# EAGLE schematic STM32L052_Breakout (EAGLE 9.1.1)
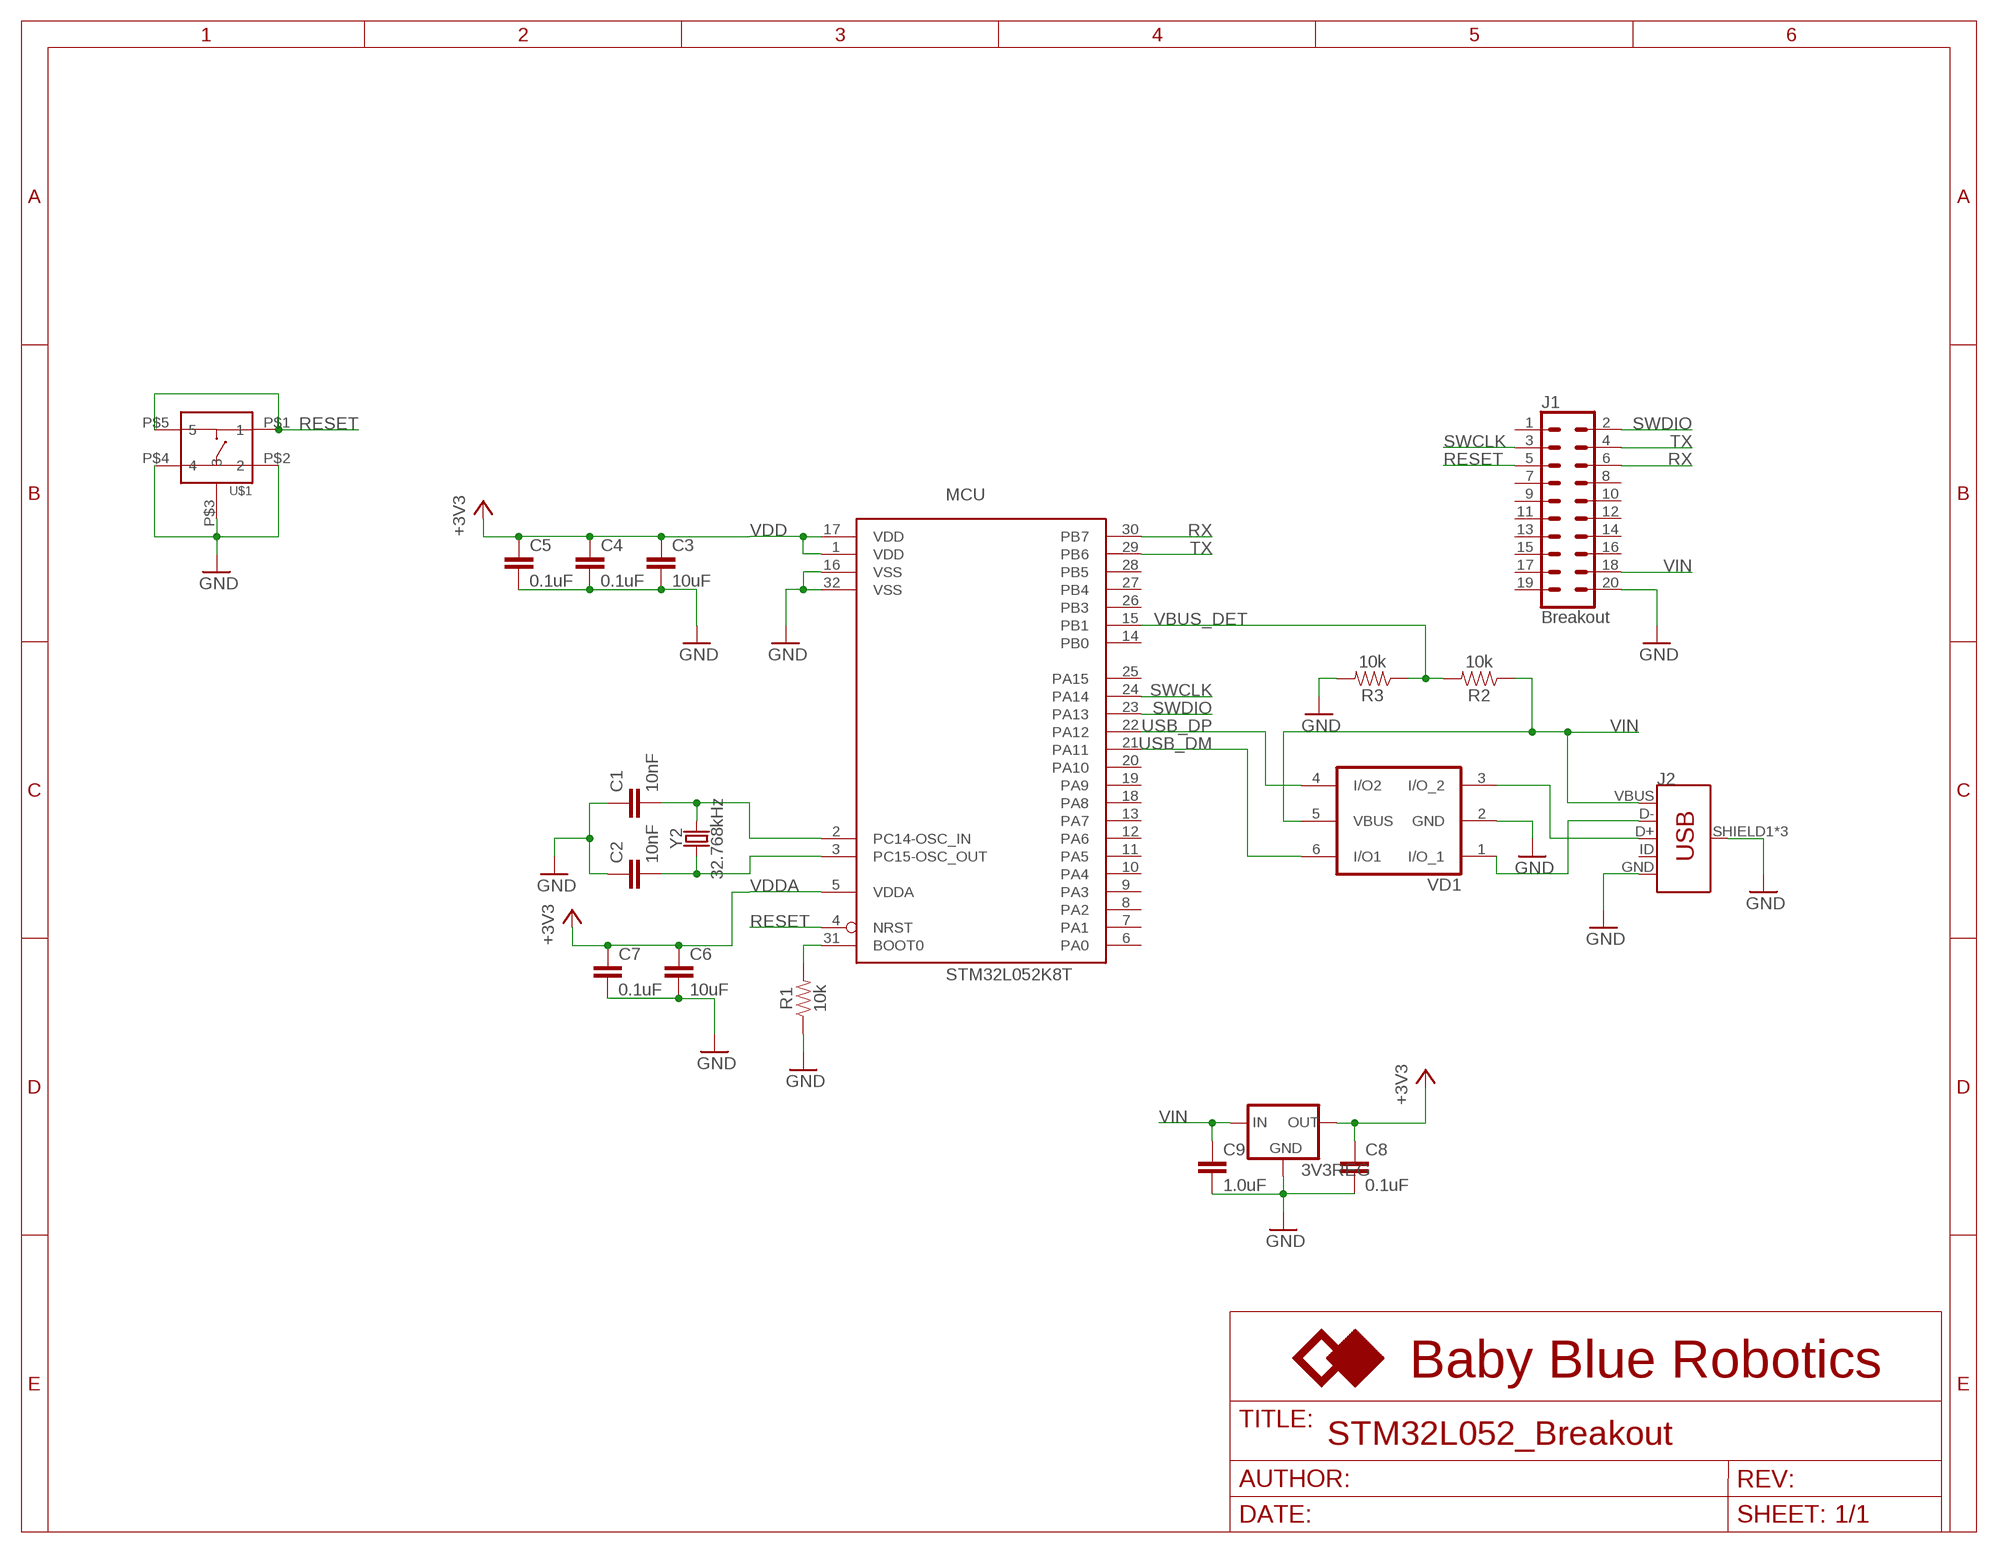
[diagram p0: schematic, sheet 1]
FRAME1 (FRAME_A_L): AUTHOR_NAME: Binit Shah; DATE_MODIFIED: 7/25/2018; REV: 1.0.0

## Parts
3V3REG  TLV76033DBZT  [SOT95P237X112-3]
C1  10nF  10NF-0603-50V-10%  [0603]
C2  10nF  10NF-0603-50V-10%  [0603]
C3  10uF  10UF-0603-6.3V-20%  [0603]
C4  0.1uF  0.1UF-0603-25V-(+80/-20%)  [0603]
C5  0.1uF  0.1UF-0603-25V-(+80/-20%)  [0603]
C6  10uF  10UF-0603-6.3V-20%  [0603]
C7  0.1uF  0.1UF-0603-25V-(+80/-20%)  [0603]
C8  0.1uF  0.1UF-0603-25V-(+80/-20%)  [0603]
C9  1.0uF  1.0UF-0603-16V-10%  [0603]
J1  Breakout  CONN_10X2  [2X10]
J2  USB_MICRO-B_FEMALE-SMT  [USB-B-MICRO-SMD]
MCU  STM32L052K8T  MICRO-STM_V3_STM32L052K8T  [MICRO-STM_V3_LQFP32]
R1  10k  10KOHM-0603-1/10W-1%  [0603]
R2  10k  10KOHM-0603-1/10W-1%  [0603]
R3  10k  10KOHM-0603-1/10W-1%  [0603]
U$1  KMS231GLFS  [KMS231GLFS]
VD1  USBLC6_USBLC6-2SC6  [USBLC6_SOT-23-6L]
Y2  32.768kHz  CRYSTAL-32.768KHZSMD-3.2X1.5  [CRYSTAL-SMD-3.2X1.5MM]

## Nets
+3V3: 3V3REG.1(OUT) C8.1
GND: 3V3REG.3(GND) C1.1 C2.1 C3.2 C4.2 C5.2 C6.2 C7.2 C8.2 C9.2 J1.20 J2.GND J2.SHIELD1(SHIELD) J2.SHIELD2(SHIELD) J2.SHIELD3(SHIELD) MCU.16(VSS) MCU.32(VSS) R1.1 R3.2 U$1.P$2 U$1.P$3 U$1.P$4 VD1.2(GND)
N$1: MCU.31(BOOT0) R1.2
N$2: C2.2 MCU.3(PC15-OSC_OUT) Y2.P$1
N$3: C1.2 MCU.2(PC14-OSC_IN) Y2.P$2
N$5: J2.D+ VD1.3(I/O_2)
N$6: J2.D- VD1.1(I/O_1)
RESET: J1.5 MCU.4(NRST) U$1.P$1 U$1.P$5
RX: J1.6 MCU.30(PB7)
SWCLK: J1.3 MCU.24(PA14)
SWDIO: J1.2 MCU.23(PA13)
TX: J1.4 MCU.29(PB6)
USB_DM: MCU.21(PA11) VD1.6(I/O1)
USB_DP: MCU.22(PA12) VD1.4(I/O2)
VBUS_DET: MCU.15(PB1) R2.2 R3.1
VDD: C3.1 C4.1 C5.1 MCU.1(VDD) MCU.17(VDD) ; supply symbol labelled +3V3
VDDA: C6.1 C7.1 MCU.5(VDDA) ; supply symbol labelled +3V3
VIN: 3V3REG.2(IN) C9.1 J1.18 J2.VBUS R2.1 VD1.5(VBUS)
Unconnected: J1.1 J1.7 J1.8 J1.9 J1.10 J1.11 J1.12 J1.13 J1.14 J1.15 J1.16 J1.17 J1.19 J2.ID MCU.6(PA0) MCU.7(PA1) MCU.8(PA2) MCU.9(PA3) MCU.10(PA4) MCU.11(PA5) MCU.12(PA6) MCU.13(PA7) MCU.14(PB0) MCU.18(PA8) MCU.19(PA9) MCU.20(PA10) MCU.25(PA15) MCU.26(PB3) MCU.27(PB4) MCU.28(PB5)

## Library data of the parts
3V3REG = TLV76033DBZT:TLV76033DBZT: TLV76033DBZT A Linear Regulator by TI that outputs 3.3v Arrow https://www.arrow.com/en/products/tlv76033dbzt/texas-instruments Datasheet https://www.snapeda.com/parts/TLV76033DBZT/Texas%20Instruments/datasheet/ EasyEDA A EasyEDA footprint was imported before I used the Eagle Package generator to generate the 3D model and footprint. I'm keeping the EasyEDA one in case the Eagle generated one does not work.
C1 C2 = SparkFun-Capacitors:10NF: 0.01uF/10nF/10,000pF ceramic capacitors A capacitor is a passive two-terminal electrical component used to store electrical energy temporarily in an electric field. CAP-09321; PROD_ID: CAP-00867
C3 C6 = SparkFun-Capacitors:10UF: 10.0µF ceramic capacitors A capacitor is a passive two-terminal electrical component used to store electrical energy temporarily in an electric field.; PROD_ID: CAP-11015
C4 C5 C7 C8 = SparkFun-Capacitors:0.1UF: 0.1µF ceramic capacitors A capacitor is a passive two-terminal electrical component used to store electrical energy temporarily in an electric field.; PROD_ID: CAP-00810
C9 = SparkFun-Capacitors:1.0UF: 1µF ceramic capacitors A capacitor is a passive two-terminal electrical component used to store electrical energy temporarily in an electric field.; PROD_ID: CAP-00868
J1 = SparkFun-Connectors:CONN_10X2: Multi connection point. Often used as Generic Header-pin footprint for 0.1 inch spaced/style header connections On any of the 0.1 inch spaced packages, you can populate with these: Break Away Headers - Straight <https://www.sparkfun.com/products/116> (PRT-00116) Break Away Male Headers - Right Angle <https://www.sparkfun.com/products/553> (PRT-00553) Female Headers <https://www.sparkfun.com/products/115> (PRT-00115) Break Away Headers - Machine Pin <https://www.sparkfun.com/products/117> (PRT-00117) Break Away Female Headers - Swiss Machine Pin <https://www.sparkfun.com/products/743> (PRT-00743) Special note about the "SPECIAL" package: This was SPECIALLY designed to be used with our Graphic LCD Backpack. Be sure you want to use this! It is not only staggered on each line of header holes, but IT IS ALSO offset of the center point of the top and bottom lines by 5 mil. This causes the headers to lock into place on the "standard" footprint on the LCD screen. The extra squares on the tdocu layer are there simply to reference other pins (if you were to actually populate a longer header than ten long - this is what we do with the backpacks).
J2 = SparkFun-Connectors:USB_MICRO-B: USB Type Micro-B Connector Male/female and PTH/SMT variants SparkFun Products: SparkFun microB USB Breakout <https://www.sparkfun.com/products/12035> SparkFun USB microB Plug Breakout <https://www.sparkfun.com/products/10031> SparkFun ESP8266 Thing <https://www.sparkfun.com/products/13231>; PROD_ID: CONN-11752
MCU = STM32L052:MICRO-STM_V3_STM32L052K*T: ARM 32-bit Cortex™-M0+ CPU 32 MHz maximum frequency 32 to 64 Kbytes of Flash memory 2 kbyte of Data EEPROM 8 kbytes of SRAM 27 GPIOs 1.8 to 3.6 V application supply
R1-R3 = SparkFun-Resistors:10KOHM: 10kΩ resistor A resistor is a passive two-terminal electrical component that implements electrical resistance as a circuit element. Resistors act to reduce current flow, and, at the same time, act to lower voltage levels within circuits. - Wikipedia; PROD_ID: RES-00824
U$1 = KMS_Switches:KMS231GLFS
VD1 = USBC6:USBLC6_USBLC6-2: VERY LOW CAPACITANCE ESD PROTECTION 2 line Datasheet link <http://www.st.com/web/catalog/sense_power/FM114/CL1137/SC1489/PF93353>
Y2 = SparkFun-Clocks:CRYSTAL-32.768KHZ: 32.768kHz Crystal Frequency: 32.768kHz Frequency Stability: ±20ppm Load Capacitance: 12.5pF (PTH-2X6 & SMD-3.2X1.5), 6pF (SMD-2X6) SparkFun Products: SparkFun BigTime Watch Kit <https://www.sparkfun.com/products/11734> SparkFun nRF52832 Breakout <https://www.sparkfun.com/products/13990> SparkFun Real Time Clock Module <https://www.sparkfun.com/products/12708>; PROD_ID: XTAL-13062